# EAGLE schematic schematic (EAGLE 7.4.0)
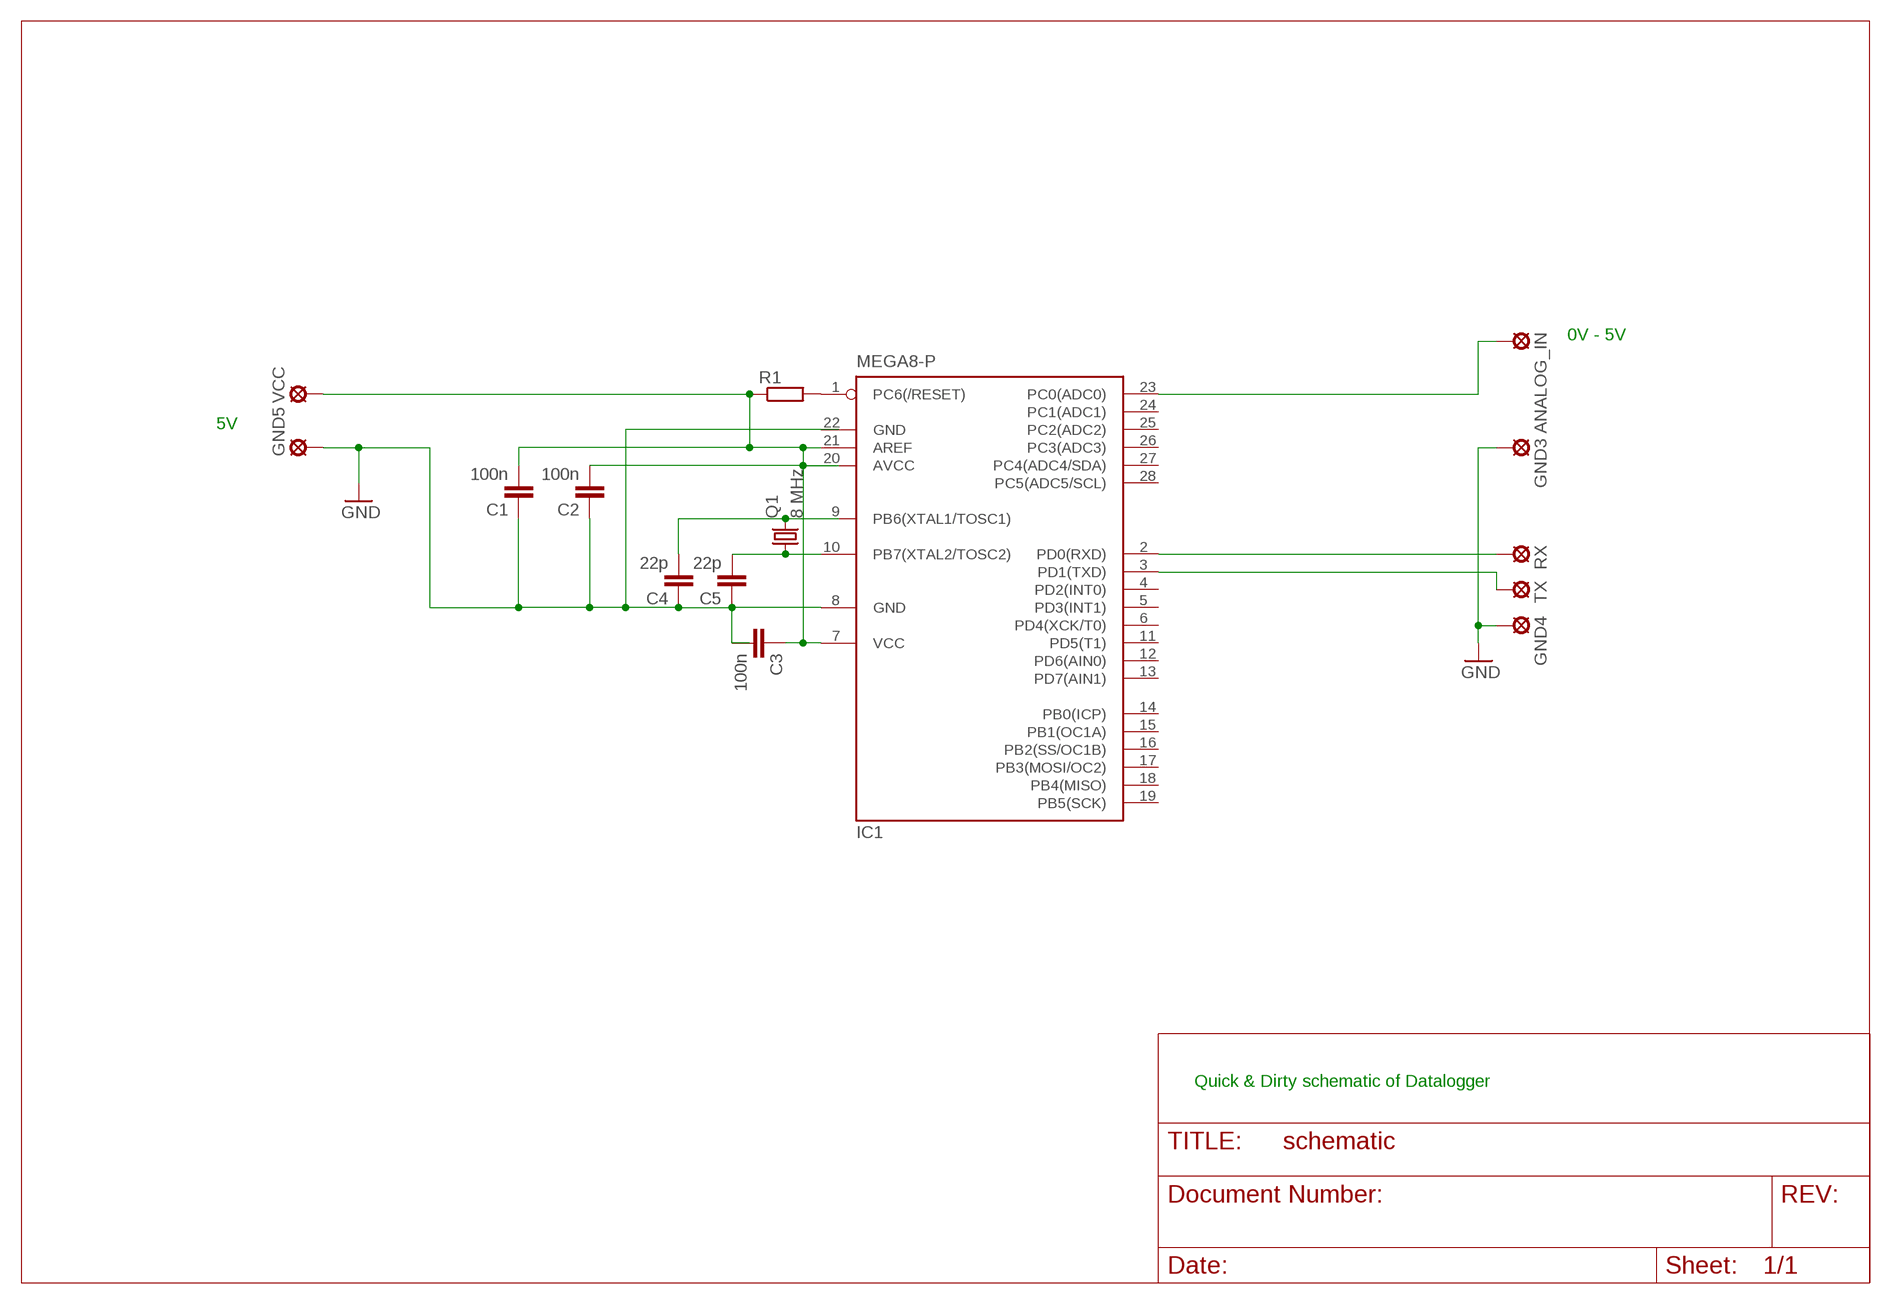
[diagram p0: schematic, sheet 1]

## Parts
ANALOG_IN  LSP10  [LSP10]
C1  100n  C5/2.5  [C5B2.5]
C2  100n  C5/2.5  [C5B2.5]
C3  100n  C5/2.5  [C5B2.5]
C4  22p  C2,5-3  [C2.5-3]
C5  22p  C2,5-3  [C2.5-3]
GND3  LSP10  [LSP10]
GND4  LSP10  [LSP10]
GND5  LSP10  [LSP10]
IC1  MEGA8-P  [DIL28-3]
Q1  8 MHz  CRYSTALHC18U-V  [HC18U-V]
R1  R-EU_0207/7  [0207/7]
RX  LSP10  [LSP10]
TX  LSP10  [LSP10]
VCC  LSP10  [LSP10]

## Nets
GND: C1.1 C2.1 C4.1 C5.1 GND3.MP GND4.MP GND5.MP IC1.8(GND)
N$1: IC1.2(PD0(RXD)) RX.MP
N$2: IC1.3(PD1(TXD)) TX.MP
N$3: ANALOG_IN.MP IC1.23(PC0(ADC0))
N$6: C4.2 Q1.2
N$7: C5.2 IC1.10(PB7(XTAL2/TOSC2)) Q1.1
N$8: C1.2 C2.2 C3.1 IC1.7(VCC) IC1.21(AREF) R1.1 VCC.MP
N$9: IC1.1(PC6(/RESET)) R1.2
Unconnected: C3.2 IC1.4(PD2(INT0)) IC1.5(PD3(INT1)) IC1.6(PD4(XCK/T0)) IC1.9(PB6(XTAL1/TOSC1)) IC1.11(PD5(T1)) IC1.12(PD6(AIN0)) IC1.13(PD7(AIN1)) IC1.14(PB0(ICP)) IC1.15(PB1(OC1A)) IC1.16(PB2(SS/OC1B)) IC1.17(PB3(MOSI/OC2)) IC1.18(PB4(MISO)) IC1.19(PB5(SCK)) IC1.24(PC1(ADC1)) IC1.25(PC2(ADC2)) IC1.26(PC3(ADC3)) IC1.27(PC4(ADC4/SDA)) IC1.28(PC5(ADC5/SCL))

## Notes on the sheet
- 0V - 5V
- 5V
- Quick & Dirty schematic of Datalogger

## Power pins joined to a net without a drawn wire
AVCC: IC1.20(AVCC)
GND: IC1.22(GND)

## Library data of the parts
ANALOG_IN GND3-GND5 RX TX VCC = solpad:LSP10: SOLDER PAD drill 1.0 mm, distributor Buerklin, 12H555
C1-C5 = capacitor-wima:C: CAPACITOR naming: grid - package width
IC1 = atmel:MEGA8-P: MICROCONTROLLER 8 Kbytes FLASH, 1 kbytes SRAM, 512 bytes EEPROM, USART, 4-channel 10 bit ADC, 2-channel 8 bit ADC Pin compatible with Atmega48, ATMega88, ATMega168 Source: avr.lbr; OC_FARNELL: unknown; OC_NEWARK: unknown
Q1 = crystal:CRYSTAL: CRYSTAL; OC_FARNELL: unknown; OC_NEWARK: unknown
R1 = rcl:R-EU_: RESISTOR, European symbol